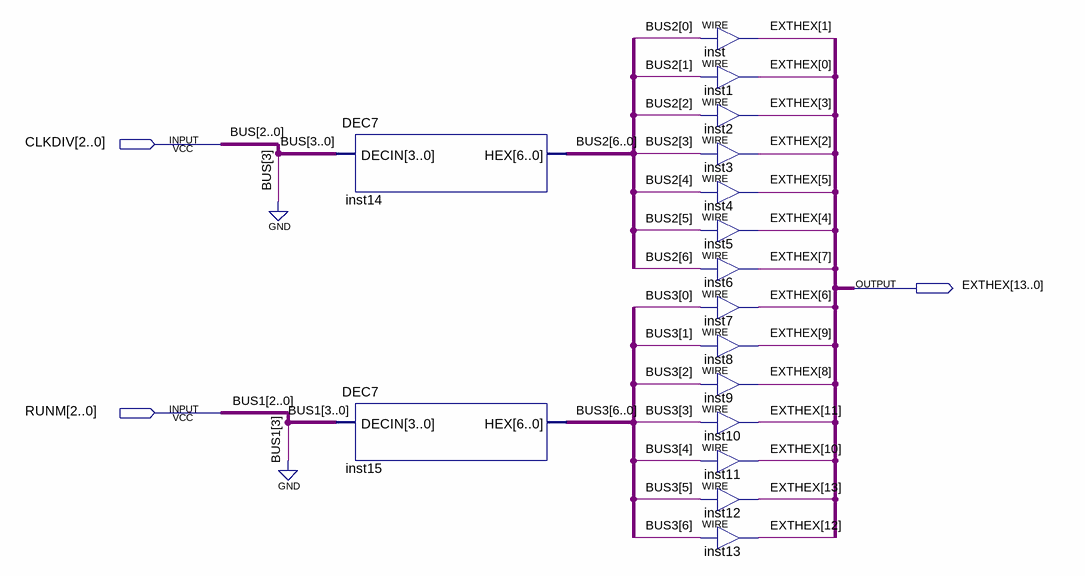
[diagram p0: schematic sheet]
// Quartus schematic exthex_decoder.bdf as structural Verilog: 16 symbols, 3 pins
module exthex_decoder (
  input  [2:0] CLKDIV,
  input  [2:0] RUNM,
  output [13:0] EXTHEX
);

  wire [6:0] BUS2, BUS3;

  DEC7 inst14 (.DECIN({1'b0, CLKDIV}), .HEX(BUS2));
  DEC7 inst15 (.DECIN({1'b0, RUNM}), .HEX(BUS3));
  assign EXTHEX[1] = BUS2[0];  // WIRE inst
  assign EXTHEX[0] = BUS2[1];  // WIRE inst1
  assign EXTHEX[3] = BUS2[2];  // WIRE inst2
  assign EXTHEX[2] = BUS2[3];  // WIRE inst3
  assign EXTHEX[5] = BUS2[4];  // WIRE inst4
  assign EXTHEX[4] = BUS2[5];  // WIRE inst5
  assign EXTHEX[7] = BUS2[6];  // WIRE inst6
  assign EXTHEX[6] = BUS3[0];  // WIRE inst7
  assign EXTHEX[9] = BUS3[1];  // WIRE inst8
  assign EXTHEX[8] = BUS3[2];  // WIRE inst9
  assign EXTHEX[11] = BUS3[3];  // WIRE inst10
  assign EXTHEX[10] = BUS3[4];  // WIRE inst11
  assign EXTHEX[13] = BUS3[5];  // WIRE inst12
  assign EXTHEX[12] = BUS3[6];  // WIRE inst13

  // Other names for the same wires on the sheet: BUS[2:0] = CLKDIV; BUS1[2:0] = RUNM
endmodule
